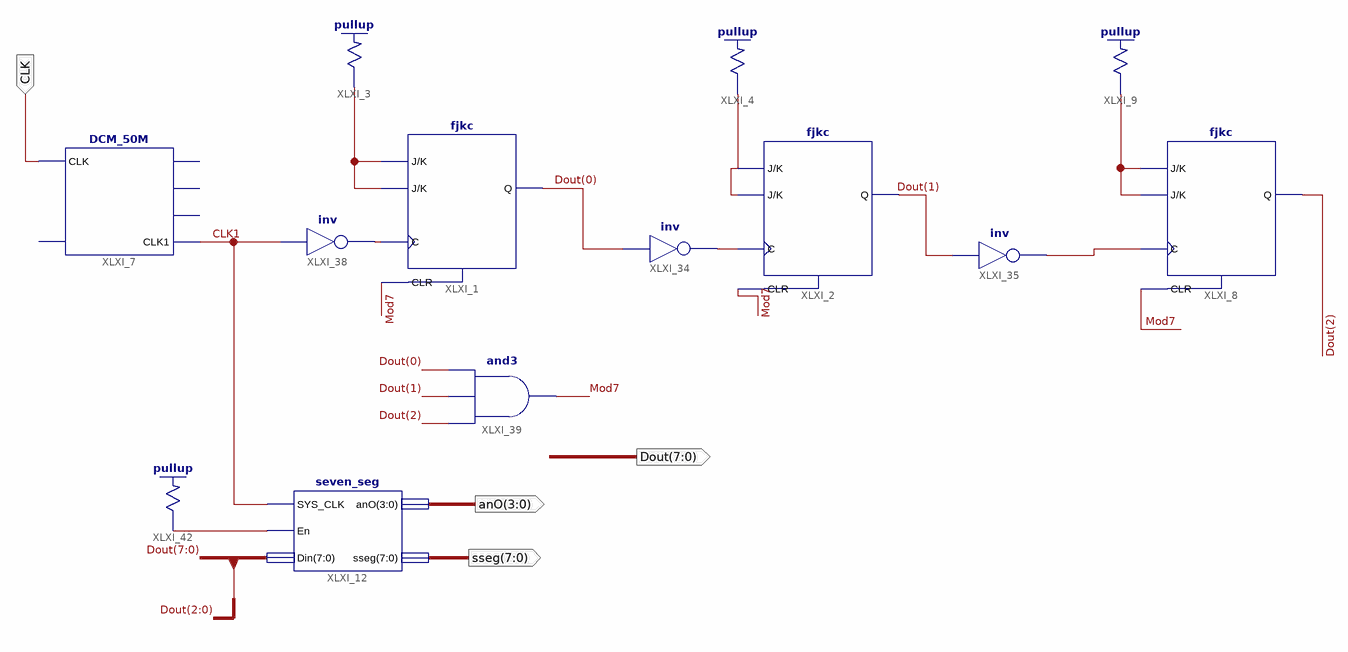
[diagram p0: schematic sheet 1]
// Xilinx ISE schematic Exp3.sch (spartan3e) as structural Verilog: 13 symbols, 4 ports
module Exp3 (
  input  CLK,
  output [7:0] sseg,
  output [7:0] Dout,
  output [3:0] anO
);

  wire CLK1, Mod7, Push, XLXN_1, XLXN_2, XLXN_15, XLXN_66, XLXN_69, XLXN_71;

  fjkc XLXI_1 (.C(XLXN_66), .CLR(Mod7), .J(XLXN_2), .K(XLXN_2), .Q(Dout[0]));
  \pullup  XLXI_3 (.O(XLXN_2));
  DCM_50M XLXI_7 (.CLK(CLK), .CLK1(CLK1));  // open: RST, CLK1M, CLK10k, CLK1k
  fjkc XLXI_8 (.C(XLXN_71), .CLR(Mod7), .J(XLXN_15), .K(XLXN_15), .Q(Dout[2]));
  \pullup  XLXI_9 (.O(XLXN_15));
  \pullup  XLXI_4 (.O(XLXN_1));
  fjkc XLXI_2 (.C(XLXN_69), .CLR(Mod7), .J(XLXN_1), .K(XLXN_1), .Q(Dout[1]));
  not XLXI_34 (XLXN_69, Dout[0]);
  not XLXI_35 (XLXN_71, Dout[1]);
  not XLXI_38 (XLXN_66, CLK1);
  and XLXI_39 (Mod7, Dout[2], Dout[1], Dout[0]);
  seven_seg XLXI_12 (.SYS_CLK(CLK1), .En(Push), .Din(Dout), .anO(anO), .sseg(sseg));
  \pullup  XLXI_42 (.O(Push));
endmodule
